# Altium schematic sheet Sheet2.SchDoc
size A4
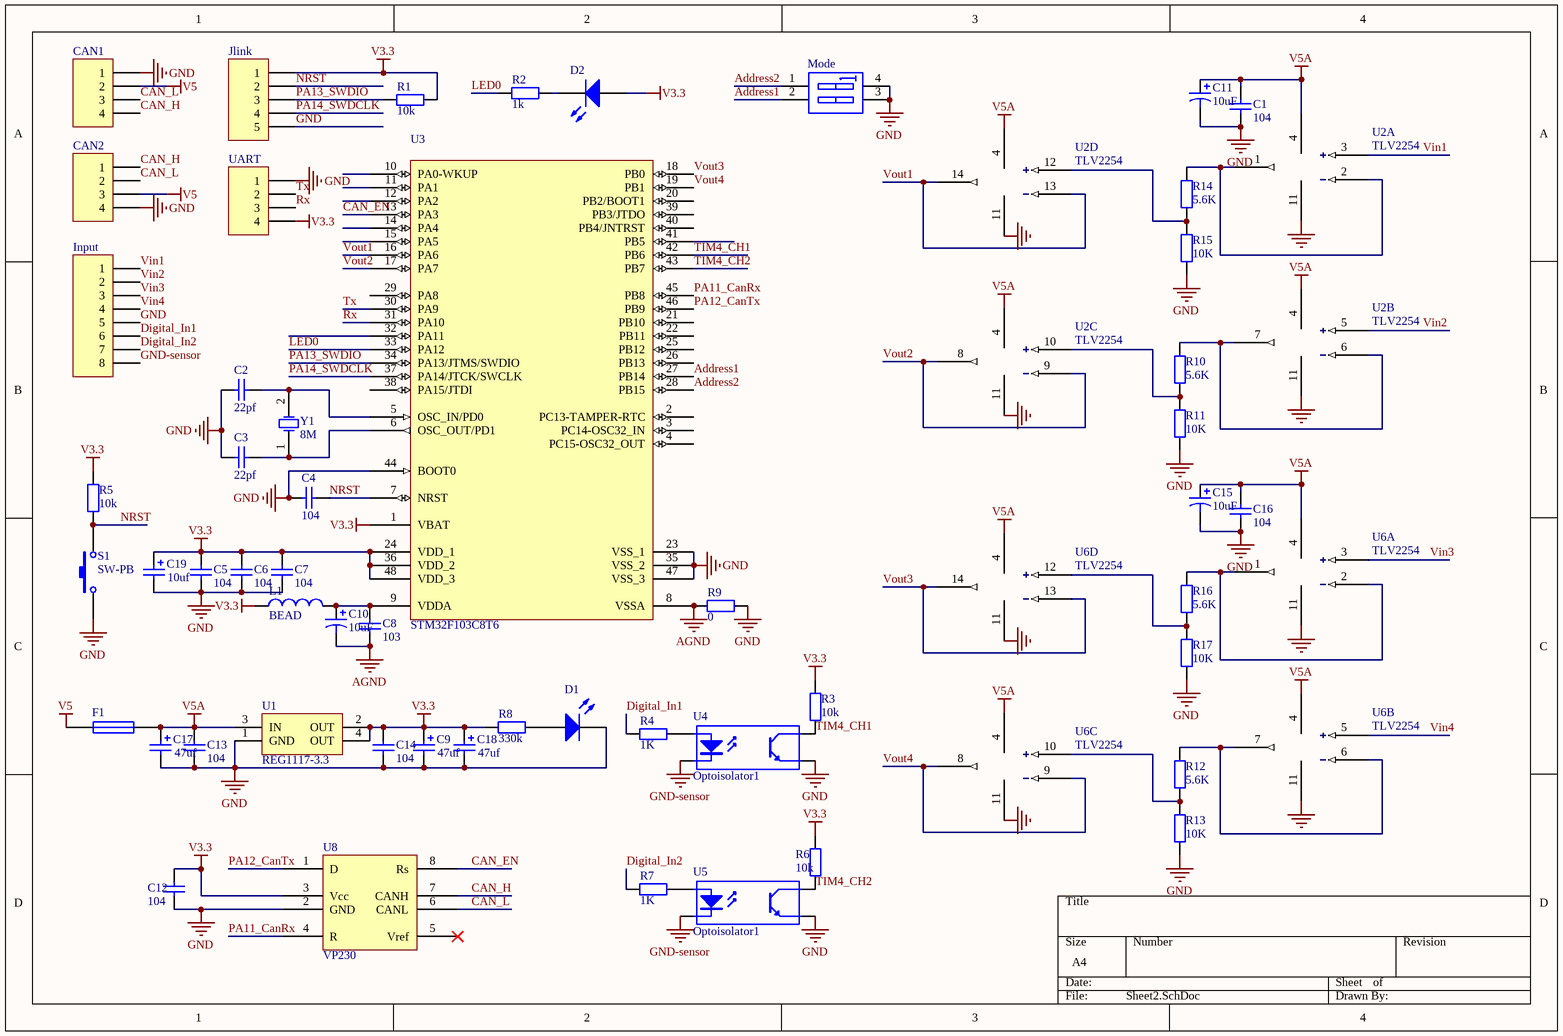
[diagram p0: Sheet2.SchDoc]

## Parts
C1  value 104  [C0805]  (hidden comment: Cap)
C2  value 22pf  [C0805]  (hidden comment: Cap)
C3  value 22pf  [C0805]  (hidden comment: Cap)
C4  value 104  [C0805]  (hidden comment: Cap)
C5  value 104  [C0805]  (hidden comment: Cap)
C6  value 104  [C0805]  (hidden comment: Cap)
C7  value 104  [C0805]  (hidden comment: Cap)
C8  value 103  [C0805]  (hidden comment: Cap)
C9  value 47uf  [1812]  (hidden comment: Cap Pol2)
C10  value 10uF  [1206]  (hidden comment: Cap Pol1)
C11  value 10uF  [1206]  (hidden comment: Cap Pol1)
C12  value 104  [C0805]  (hidden comment: Cap)
C13  value 104  [C0805]  (hidden comment: Cap)
C14  value 104  [C0805]  (hidden comment: Cap)
C15  value 10uF  [1206]  (hidden comment: Cap Pol1)
C16  value 104  [C0805]  (hidden comment: Cap)
C17  value 47uf  [1812]  (hidden comment: Cap Pol2)
C18  value 47uf  [1812]  (hidden comment: Cap Pol2)
C19  value 10uf  [1206]  (hidden comment: Cap Pol2)
CAN1  Header 4  [DuraClik*4]  (value not drawn)
CAN2  Header 4  [DuraClik*4]  (value not drawn)
D1  LED2  [C0805]  (value not drawn)
D2  LED2  [C0805]  (value not drawn)
F1  Fuse 1  [1812]  (value not drawn)
Input  Header 8  [DuraClik*8]  (value not drawn)
Jlink  Jlink  [HDR1X5]  (value not drawn)
L1  value BEAD  [C0805]  (hidden comment: Inductor)
Mode  SW DIP-2  [DIP-4]  (value not drawn)
R1  value 10k  [C0805]  (hidden comment: Res2)
R2  value 1k  [C0805]  (hidden comment: Res2)
R3  value 10k  [C0805]  (hidden comment: Res2)
R4  value 1K  [C0805]  (hidden comment: Res2)
R5  value 10k  [C0805]  (hidden comment: Res2)
R6  value 10k  [C0805]  (hidden comment: Res2)
R7  value 1K  [C0805]  (hidden comment: Res2)
R8  value 330k  [C0805]  (hidden comment: Res2)
R9  value 0  [C0805]  (hidden comment: Res2)
R10  value 5.6K  [C0805]  (hidden comment: Res2)
R11  value 10K  [C0805]  (hidden comment: Res2)
R12  value 5.6K  [C0805]  (hidden comment: Res2)
R13  value 10K  [C0805]  (hidden comment: Res2)
R14  value 5.6K  [C0805]  (hidden comment: Res2)
R15  value 10K  [C0805]  (hidden comment: Res2)
R16  value 5.6K  [C0805]  (hidden comment: Res2)
R17  value 10K  [C0805]  (hidden comment: Res2)
S1  SW-PB  [button_SMD]
U1  REG1117-3.3  [ZZ311]
U2  TLV2254  [TSSOP14]  (parts A,B,C,D of 4)
U3  STM32F103C8T6  [LQFP48_N]
U4  Optoisolator1  [SOP4-large]
U5  Optoisolator1  [SOP4-large]
U6  TLV2254  [TSSOP14]  (parts A,B,C,D of 4)
U8  VP230  [SOP127P600X175-8M]
UART  Header 4  [HDR1X4]  (value not drawn)
Y1  8M  [XTAL]

## Nets
AGND: C8.2 C10.2 R9.2 U3.8(VSSA)
GND: C1.2 C2.1 C3.1 C4.1 C5.2 C6.2 C7.2 C9.2 C11.2 C12.1 C13.2 C14.2 C15.2 C16.2 C17.2 C18.2 C19.2 CAN1.1 CAN2.4 D1.2(K) Input.5 Jlink.5 Mode.3(B2) Mode.4(B1) R9.1 R11.1 R13.1 R15.1 R17.1 S1.1 U1.1(GND) U2.11(GND) U3.23(VSS_1) U3.35(VSS_2) U3.44(BOOT0) U3.47(VSS_3) U4.3(E) U5.3(E) U6.11(GND) U8.2(GND) UART.1
GND-sensor: Input.8 U4.2(K) U5.2(K)
V3.3: C5.1 C6.1 C7.1 C9.1 C12.2 C14.1 C18.1 C19.1 D2.1(A) Jlink.1 L1.1 R1.2 R3.1 R5.1 R6.2 R8.2 U1.2(OUT) U1.4(OUT) U3.1(VBAT) U3.24(VDD_1) U3.36(VDD_2) U3.48(VDD_3) U8.3(Vcc) UART.4
V5: CAN1.2 CAN2.3 F1.2
V5A: C1.1 C11.1 C13.1 C15.1 C16.1 C17.1 F1.1 U1.3(IN) U2.4(Vcc) U6.4(Vcc)
Address1: Mode.2(A2) U3.27(PB14)
Address2: Mode.1(A1) U3.28(PB15)
CAN_EN: U3.13(PA3) U8.8(Rs)
CAN_H: CAN1.4 CAN2.1 U8.7(CANH)
CAN_L: CAN1.3 CAN2.2 U8.6(CANL)
Digital_In1: Input.6 R4.2
Digital_In2: Input.7 R7.2
LED0: R2.1 U3.33(PA12)
NRST: C4.2 Jlink.2 R5.2 S1.2 U3.7(NRST)
PA11_CanRx: U3.45(PB8) U8.4(R)
PA12_CanTx: U3.46(PB9) U8.1(D)
PA13_SWDIO: Jlink.3 R1.1 U3.34(PA13/JTMS/SWDIO)
PA14_SWDCLK: Jlink.4 U3.37(PA14/JTCK/SWCLK)
Rx: U3.31(PA10) UART.3
TIM4_CH1: R3.2 U3.42(PB6) U4.4(C)
TIM4_CH2: R6.1 U3.43(PB7) U5.4(C)
Tx: U3.30(PA9) UART.2
Vin1: Input.1 U2.3(1IN+)
Vin2: Input.2 U2.5(2IN+)
Vin3: Input.3 U6.3(1IN+)
Vin4: Input.4 U6.5(2IN+)
Vout1: U2.13(4IN-) U2.14(4OUT) U3.16(PA6)
Vout2: U2.8(3OUT) U2.9(3IN-) U3.17(PA7)
Vout3: U3.18(PB0) U6.13(4IN-) U6.14(4OUT)
Vout4: U3.19(PB1) U6.8(3OUT) U6.9(3IN-)
NetC2_2: C2.2 U3.5(OSC_IN/PD0) Y1.2(OSC2)
NetC3_2: C3.2 U3.6(OSC_OUT/PD1) Y1.1(OSC1)
NetC8_1: C8.1 C10.1 L1.2 U3.9(VDDA)
NetD1_1: D1.1(A) R8.1
NetD2_2: D2.2(K) R2.2
NetR4_1: R4.1 U4.1(A)
NetR7_1: R7.1 U5.1(A)
NetR10_1: R10.1 R11.2 U2.10(3IN+)
NetR10_2: R10.2 U2.6(2IN-) U2.7(2OUT)
NetR12_1: R12.1 R13.2 U6.10(3IN+)
NetR12_2: R12.2 U6.6(2IN-) U6.7(2OUT)
NetR14_1: R14.1 R15.2 U2.12(4IN+)
NetR14_2: R14.2 U2.1(1OUT) U2.2(1IN-)
NetR16_1: R16.1 R17.2 U6.12(4IN+)
NetR16_2: R16.2 U6.1(1OUT) U6.2(1IN-)

Not connected (* = marked no-connect by the designer): U3 2(PC13-TAMPER-RTC) 3(PC14-OSC32_IN) 4(PC15-OSC32_OUT) 10(PA0-WKUP) 11(PA1) 12(PA2) 14(PA4) 15(PA5) 20(PB2/BOOT1) 21(PB10) 22(PB11) 25(PB12) 26(PB13) 29(PA8) 32(PA11) 38(PA15/JTDI) 39(PB3/JTDO) 40(PB4/JNTRST) 41(PB5); U8 5(Vref)*

## Library data of the parts
C1-C8 C12-C14 C16 = Cap: Capacitor; Published: 8-Jun-2000; LatestRevisionDate: 17-Jul-2002; LatestRevisionNote: Re-released for DXP Platform.; PackageReference: RAD-0.3; Publisher: Altium Limited; PackageDescription: Radial Cap, Thru-Hole; 2 Leads; 0.3 in Pin Spacing
C9 C17-C19 = Cap Pol2: Polarized Capacitor (Axial); Published: 8-Jun-2000; LatestRevisionDate: 17-Jul-2002; LatestRevisionNote: Re-released for DXP Platform.; PackageReference: POLAR0.8; Publisher: Altium Limited; PackageDescription: Polarized Capacitor; 2 Leads
C10 C11 C15 = Cap Pol1: Polarized Capacitor (Radial); Published: 8-Jun-2000; LatestRevisionDate: 17-Jul-2002; LatestRevisionNote: Re-released for DXP Platform.; PackageReference: RB7.6-15; Publisher: Altium Limited
CAN1 CAN2 UART = Header 4: Header, 4-Pin; LatestRevisionDate: 17-Jul-2002; LatestRevisionNote: Re-released for DXP Platform.; Publisher: Altium Limited
D1 D2 = LED2: Typical RED, GREEN, YELLOW, AMBER GaAs LED; Published: 8-Jun-2000; LatestRevisionDate: 17-Jul-2002; LatestRevisionNote: Re-released for DXP Platform.; PackageVersion: Feb-2002; PackageReference: 3.2X1.6X1.1; Publisher: Altium Limited
F1 = Fuse 1: Fuse; Published: 8-Jun-2000; LatestRevisionDate: 17-Jul-2002; LatestRevisionNote: Re-released for DXP Platform.; PackageReference: PIN-W2/E2.8; Publisher: Altium Limited
Input = Header 8: Header, 8-Pin; LatestRevisionDate: 17-Jul-2002; LatestRevisionNote: Re-released for DXP Platform.; Publisher: Altium Limited
Jlink = Header 5: Header, 5-Pin; LatestRevisionDate: 17-Jul-2002; LatestRevisionNote: Re-released for DXP Platform.; Publisher: Altium Limited
L1 = Inductor: Code_IEC: 1005; Published: 8-Jun-2000; LatestRevisionDate: 29-May-2009; LatestRevisionNote: IPC-7351 Footprint Added.; PackageReference: 0402-A; Publisher: Altium Limited; PackageDescription: Chip Inductor; Code_JEITA: 0402
Mode = SW DIP-2: DIP Switch, 2 Position, SPST; Published: 24-Mar-1999; LatestRevisionDate: 17-Jul-2002; LatestRevisionNote: Re-released for DXP Platform.; PackageReference: DIP-4; Publisher: Altium Limited
R1-R17 = Res2: Resistor; Published: 8-Jun-2000; LatestRevisionDate: 17-Jul-2002; LatestRevisionNote: Re-released for DXP Platform.; PackageReference: AXIAL-0.4; Publisher: Altium Limited
  R1-R9: PackageDescription: Axial Device, Thru-Hole; 2 Leads; 0.4 in Pin Spacing
S1 = SW-PB: Switch; Published: 24-Mar-1999; LatestRevisionDate: 17-Jul-2002; LatestRevisionNote: Re-released for DXP Platform.; PackageReference: SPST-2; Publisher: Altium Limited; PackageDescription: Switch; 2 Leads
U1 = REG1117-3.3: 800mA and 1A Low Dropout Positive Regulator 2.85V, 3.3V, 5V, and Adjustable; Published: 8-Jun-2000; LatestRevisionDate: 17-Jul-2002; LatestRevisionNote: Re-released for DXP Platform.; DatasheetVersion: Sep-1997; PackageVersion: revC; PackageReference: ZZ311; Publisher: Altium Limited; PackageDescription: SOT-223/SC-73; 4 Leads; Body 6.7 x 7.3 mm, inc. leads (LxW max); ComponentLink1Description: Manufacturer Link; ComponentLink1URL: http://www.ti.com/; ComponentLink2Description: Datasheet; ComponentLink2URL: http://www-s.ti.com/sc/ds/REG1117.pdf
U3 = STM32F103C8T6: STM32 ARM-based 32-bit MCU with 64 Kbytes Flash, 48-pin LQFP, Industrial Temperature; Published: 30-May-2008; DatasheetVersion: rev6, Mar-2008; PackageVersion: Mar-2008; PackageReference: LQFP48; Publisher: Altium Limited; PackageDescription: 48-Pin Low-Profile Quad Flat Pack, 7 x 7 mm Body, 0.5 mm Pitch (LQFP48); ComponentLink1Description: Manufacturer Link; ComponentLink1URL: www.st.com/stm32; ComponentLink2Description: Datasheet; ComponentLink2URL: http://www.st.com/stonline/products/literature/ds/13587.pdf
U4 U5 = Optoisolator1: 4-Pin Phototransistor Optocoupler; Published: 24-Mar-1999; LatestRevisionDate: 04-Mar-2005; LatestRevisionNote: Sch pins 3 & 4 Swapped.; DatasheetVersion: Nov-2003; PackageReference: DIP-4; Publisher: Altium Limited
U8 = VP230: 3.3-VCANTRANSCEIVERS
Y1 = XTAL: Crystal Oscillator; Published: 8-Jun-2000; LatestRevisionDate: 17-Jul-2002; LatestRevisionNote: Re-released for DXP Platform.; PackageReference: R38; Publisher: Altium Limited; PackageDescription: Crystal, Thru-Hole; 2 Leads; Body 3.1 x 8.2 mm (Dia.xH)